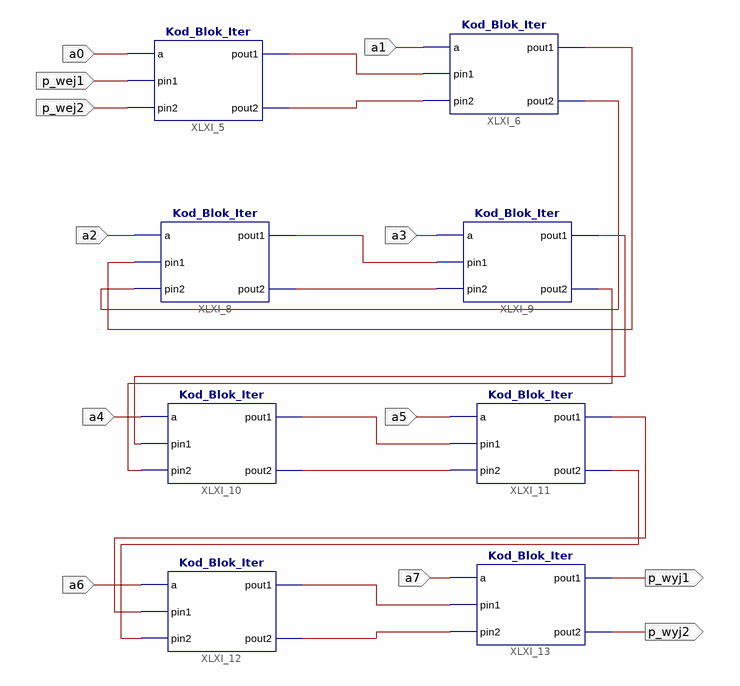
[diagram p0: schematic sheet 1]
// Xilinx ISE schematic Schemat_Uk_Iter.sch (xbr) as structural Verilog: 8 symbols, 12 ports
module Schemat_Uk_Iter (
  input  p_wej1,
  input  p_wej2,
  input  a0,
  input  a1,
  input  a3,
  input  a2,
  input  a7,
  input  a6,
  input  a4,
  input  a5,
  output p_wyj1,
  output p_wyj2
);

  wire XLXN_1, XLXN_2, XLXN_3, XLXN_4, XLXN_5, XLXN_6, XLXN_15, XLXN_16, XLXN_17, XLXN_18, XLXN_19, XLXN_20,
       XLXN_21, XLXN_22;

  Kod_Blok_Iter XLXI_5 (.a(a0), .pin1(p_wej1), .pin2(p_wej2), .pout1(XLXN_1), .pout2(XLXN_2));
  Kod_Blok_Iter XLXI_6 (.a(a1), .pin1(XLXN_1), .pin2(XLXN_2), .pout1(XLXN_3), .pout2(XLXN_4));
  Kod_Blok_Iter XLXI_8 (.a(a2), .pin1(XLXN_3), .pin2(XLXN_4), .pout1(XLXN_5), .pout2(XLXN_6));
  Kod_Blok_Iter XLXI_9 (.a(a3), .pin1(XLXN_5), .pin2(XLXN_6), .pout1(XLXN_21), .pout2(XLXN_22));
  Kod_Blok_Iter XLXI_10 (.a(a4), .pin1(XLXN_21), .pin2(XLXN_22), .pout1(XLXN_15), .pout2(XLXN_16));
  Kod_Blok_Iter XLXI_11 (.a(a5), .pin1(XLXN_15), .pin2(XLXN_16), .pout1(XLXN_17), .pout2(XLXN_18));
  Kod_Blok_Iter XLXI_12 (.a(a6), .pin1(XLXN_17), .pin2(XLXN_18), .pout1(XLXN_19), .pout2(XLXN_20));
  Kod_Blok_Iter XLXI_13 (.a(a7), .pin1(XLXN_19), .pin2(XLXN_20), .pout1(p_wyj1), .pout2(p_wyj2));
endmodule
